# EAGLE design Thermal module (EAGLE 9.5.0)
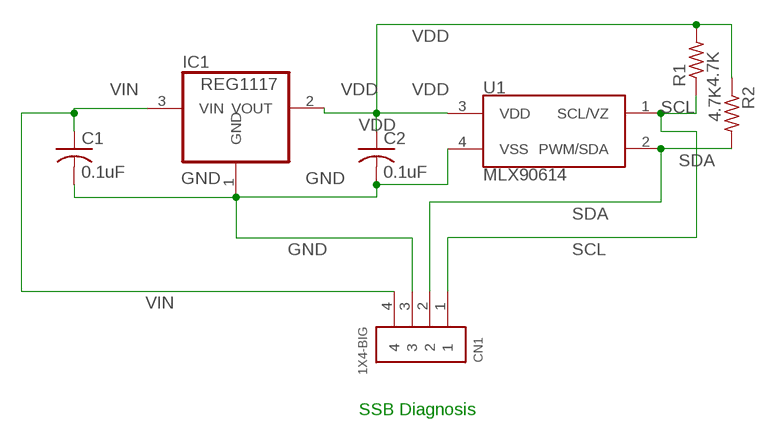
[diagram p0: schematic, sheet 1]

## Parts
C1  0.1uF  C-USC0805  [C0805]
C2  0.1uF  C-USC0805  [C0805]
CN1  1X4-BIG  [1X04-BIG]
IC1  REG1117  [SOT223]
R1  4.7K  R-US_R0805  [R0805]
R2  4.7K  R-US_R0805  [R0805]
U1  MLX90614  [TO-39]

## Nets
GND: C1.2 C2.2 CN1.3 IC1.1(GND) U1.4(VSS)
SCL: CN1.1 R1.1 U1.1(SCL/VZ)
SDA: CN1.2 R2.2 U1.2(PWM/SDA)
VDD: C2.1 IC1.2(VOUT) R1.2 R2.1 U1.3(VDD)
VIN: C1.1 CN1.4 IC1.3(VIN)

## Notes on the sheet
- SSB Diagnosis

## Library data of the parts
C1 C2 = adafruit:C-US: CAPACITOR, American symbol
CN1 = adafruit:1X4: 4-pin connector
IC1 = burr-brown:REG1117: 800mA and 1A Low Dropout (LDO) Positive Regulator 1.8V, 2.5V, 2.85V, 3.3V, 5V, and Adj; MPN: REG1117; OC_FARNELL: 1097566; OC_NEWARK: 14P6981
R1 R2 = adafruit:R-US_: RESISTOR, American symbol
U1 = SparkFun-Sensors:MLX90614: Melexis MLX90614 Infrared (IR) Thermometer The MLX90614 is a passive infrared (PIR) I2C temperature sensor.It is designed for non-contact temperature sensing. An internal 17-bit ADC and a powerful DSP contribute to the MLX90614’s high accuracy and resolution. It has a huge number of applications including body temperature measurment and movement detection. Datasheet <http://www.sparkfun.com/datasheets/Sensors/Temperature/SEN-09570-datasheet-3901090614M005.pdf> SparkFun Products Infrared Thermometer - MLX90614 <https://www.sparkfun.com/products/9570> (SEN-09570) SparkFun IR Thermometer Evaluation Board - MLX90614 <https://www.sparkfun.com/products/10740> (SEN-10740); PROD_ID: COMP-09719; SF_ID: SEN-09570

## Board
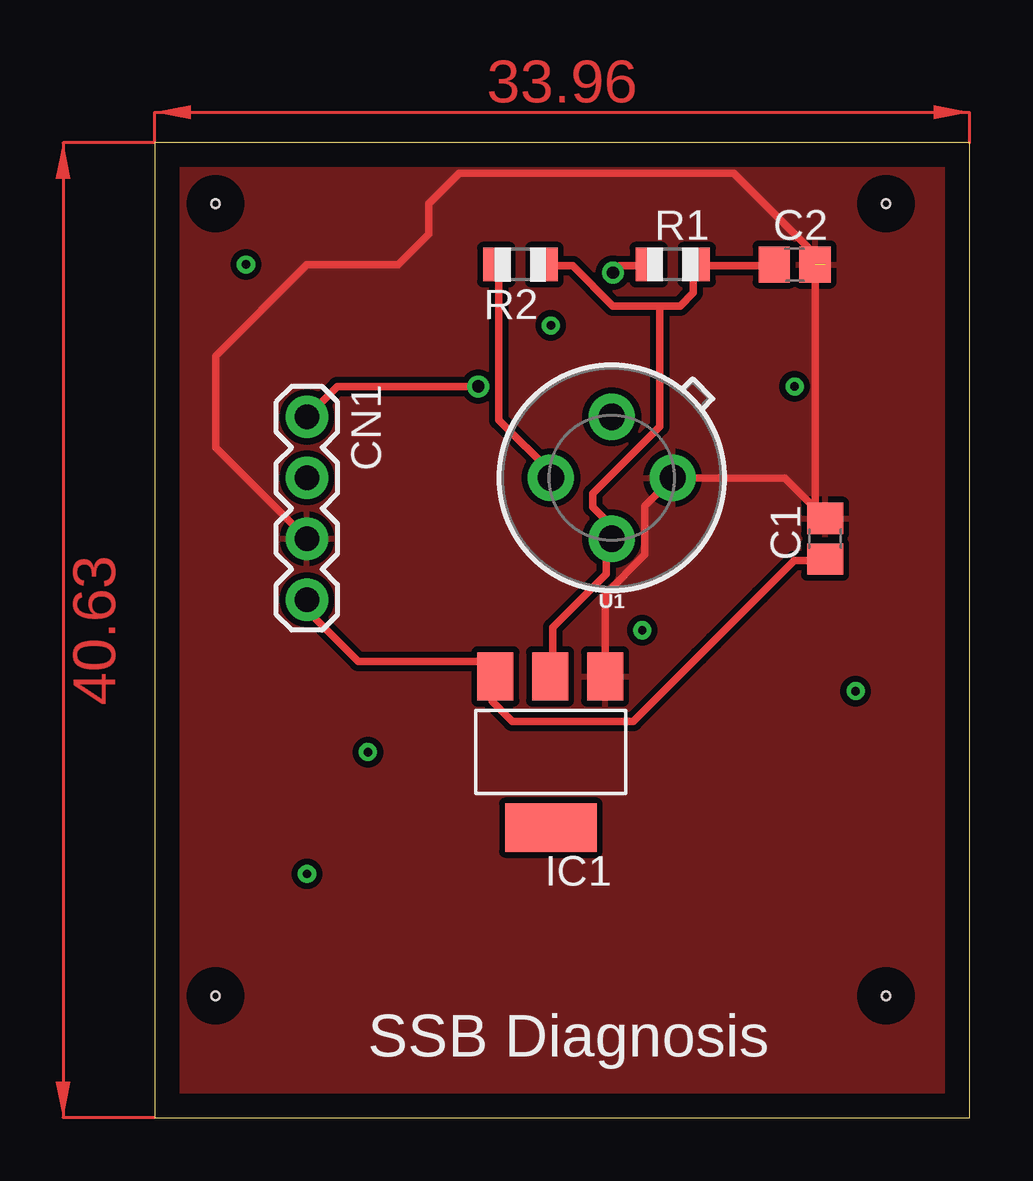
[diagram p1: board, top side]
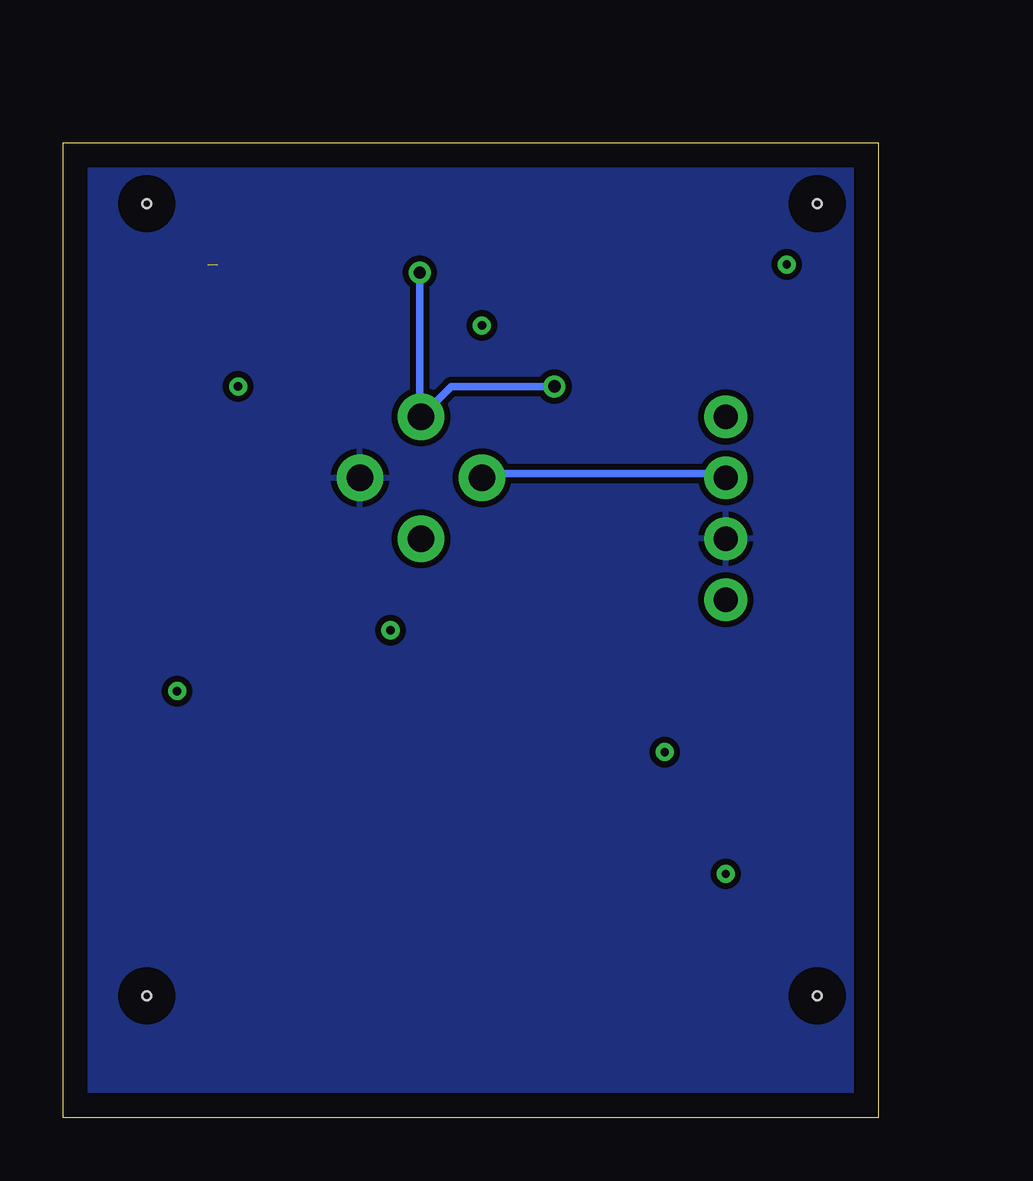
[diagram p2: board, bottom side, seen from below]

Size 33.96 x 40.63 mm. Coordinates in mm from the lower left corner, seen from the top.
Outline: 0,0 33.96,0 33.96,40.63 0,40.63 0,0
Copper layers (1*16): Top 0.035mm / dielectric 1.5mm / Bottom 0.035mm
Design rules "default": minimum track width 6mil, minimum drill 0.35mm, track to track 6mil, track to pad 6mil, pad to pad 6mil, via to via 6mil, smd to smd 6mil, copper to edge 40mil, drill to drill 6mil, minimum pad ring 10mil, minimum via ring 8mil, stop-mask expansion 4mil, vias tented up to drill 0mil, thermal gap 10mil
Holes 0.35 mm at 2.54,38.1 30.48,38.1 2.54,5.08 30.48,5.08

### Footprints (pad centres in the part's own frame; a part is rotated, then mirrored left to right if it is on the bottom)
C0805 = smd 1.3 x 1.5: 1 -0.85,0; 2 0.85,0
1X04-BIG = drill 1.016 pad 1.778: 1 0,0; 2 2.54,0; 3 5.08,0; 4 7.62,0
SOT223 = smd 1.499 x 2.007: 1 -2.261,-3.15; 2 0.025,-3.15; 3 2.311,-3.15 | smd 3.81 x 2.007: 4 0,3.15
R0805 = smd 1.1 x 1.4: 1 -1,0; 2 1,0
TO-39 = drill 1.1 pad 1.93: 1 2.54,0; 2 0,2.54; 3 -2.54,0; 4 0,-2.54

### Placement (x,y rotation side)
C1  27.94,24.13 90 top
C2  26.67,35.56 0 top
CN1  6.35,29.21 270 top
IC1  16.51,15.24 180 top
R1  21.59,35.56 0 top
R2  15.24,35.56 180 top
U1  19.05,26.67 90 top

### Tracks (layer width: path | path; a pad name or v marks a point on that pad's centre or on a via)
GND  (1 unrouted)
  Top 0.152: IC1.1 19.22,17.95 19.22,18.89
  Top 0.305: C2.2 27.52,25.4 C1.2 26.25,26.67 U1.4 20.42,25.5 20.42,23.47 18.77,21.82 IC1.1 | CN1.3 2.54,27.94 2.54,31.75 6.35,35.56 10.16,35.56 11.43,36.83 11.43,38.1 12.7,39.37 24.13,39.37 27.94,35.56
  pour Top: -1.27,41.91 -1.27,-1.27 35.56,-1.27 35.56,41.91
  pour Bottom: 0,40.64 0,0 34.29,0 34.29,40.64
N$1  (via drill 0.35)
  other vias: 3.81,35.56
N$2  (via drill 0.35)
  other vias: 16.51,33.02
N$3  (via drill 0.35)
  other vias: 26.67,30.48
N$4  (via drill 0.35)
  other vias: 29.21,17.78
N$5  (via drill 0.35)
  other vias: 8.89,15.24
N$6  (via drill 0.35)
  other vias: 20.32,20.32
N$7  (via drill 0.35)
  other vias: 6.35,10.16
SCL  (via drill 0.51)
  Top 0.305: v19.1,35.23 19.38,35.51 20.5,35.51 R1.1 | CN1.1 7.62,30.48 v13.49,30.48
  Bottom 0.305: 19.1,29.36 U1.1 | 18.82,29.36 U1.1 | 6.5,29.36 CN1.1 | U1.1 19.1,29.26 v19.1,35.23 | v13.49,30.48 17.78,30.48 U1.1
SDA
  Top 0.305: R2.2 14.35,35.51 14.35,29.08 16.59,26.85 U1.2
  Bottom 0.305: CN1.2 6.53,26.85 16.31,26.85 U1.2
VDD
  Top 0.152: 16.51,18.41 IC1.2 | 22.86,35.83 R1.2
  Top 0.305: IC1.2 16.59,18.47 16.59,20.42 18.82,22.66 18.82,24.05 U1.3 18.82,24.33 18.82,24.89 18.26,25.45 18.26,26.01 21.06,28.8 21.06,33.83 | 21.06,33.83 21.9,33.83 22.45,34.39 22.45,34.95 | 21.06,33.83 19.1,33.83 17.42,35.51 16.31,35.51 R2.1 | 22.45,34.95 22.45,35.51 R1.2 22.45,34.95 | 22.45,34.95 23.01,35.51 25.81,35.51 C2.1
VIN
  Top 0.152: 13.75,18.83 IC1.3 13.97,18.62
  Top 0.305: 22.67,19.24 19.94,16.51 14.91,16.51 14.07,17.35 14.07,18.19 IC1.3 13.79,18.75 13.79,19.02 8.48,19.02 6.53,20.98 6.53,21.54 CN1.4 | 25.21,21.78 26.65,23.22 27.76,23.22 C1.1 | 25.21,21.78 23.3,19.88 | 23.3,19.88 22.67,19.24 | 22.67,19.24 | 23.3,19.88 | 25.21,21.78
(copper drawn outside any net)
  shapes: Top area x2

### Text on the board
tNames: SSB Diagnosis